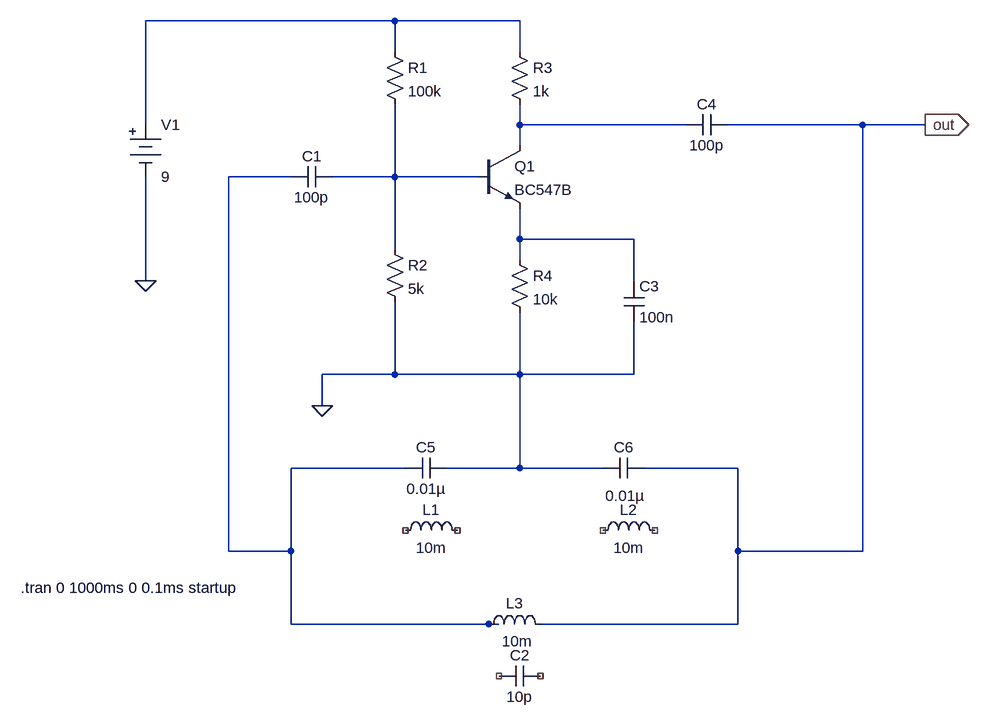
[diagram p0: schematic LC.asc]
LC.asc, the LTspice schematic file:
Version 4
SHEET 1 1376 936
WIRE 464 -128 80 -128
WIRE 656 -128 464 -128
WIRE 464 -80 464 -128
WIRE 656 -80 656 -128
WIRE 80 32 80 -128
WIRE 656 32 656 0
WIRE 912 32 656 32
WIRE 1184 32 976 32
WIRE 1280 32 1184 32
WIRE 656 64 656 32
WIRE 304 112 208 112
WIRE 464 112 464 0
WIRE 464 112 368 112
WIRE 592 112 464 112
WIRE 656 208 656 160
WIRE 832 208 656 208
WIRE 464 224 464 112
WIRE 656 240 656 208
WIRE 80 272 80 112
WIRE 832 272 832 208
WIRE 464 416 464 304
WIRE 464 416 352 416
WIRE 656 416 656 320
WIRE 656 416 464 416
WIRE 832 416 832 336
WIRE 832 416 656 416
WIRE 352 464 352 416
WIRE 480 560 304 560
WIRE 656 560 656 416
WIRE 656 560 544 560
WIRE 784 560 656 560
WIRE 992 560 848 560
WIRE 208 688 208 112
WIRE 304 688 304 560
WIRE 304 688 208 688
WIRE 992 688 992 560
WIRE 1184 688 1184 32
WIRE 1184 688 992 688
WIRE 304 800 304 688
WIRE 608 800 304 800
WIRE 624 800 608 800
WIRE 992 800 992 688
WIRE 992 800 688 800
FLAG 80 272 0
FLAG 352 464 0
FLAG 1280 32 out
IOPIN 1280 32 Out
SYMBOL res 448 -96 R0
SYMATTR InstName R1
SYMATTR Value 100k
SYMBOL res 640 -96 R0
SYMATTR InstName R3
SYMATTR Value 1k
SYMBOL res 448 208 R0
SYMATTR InstName R2
SYMATTR Value 5k
SYMBOL npn 592 64 R0
SYMATTR InstName Q1
SYMATTR Value BC547B
SYMBOL res 640 224 R0
SYMATTR InstName R4
SYMATTR Value 10k
SYMBOL cap 816 272 R0
SYMATTR InstName C3
SYMATTR Value 100n
SYMBOL cap 368 96 R90
WINDOW 0 0 32 VBottom 2
WINDOW 3 32 32 VTop 2
SYMATTR InstName C1
SYMATTR Value 100p
SYMBOL cap 976 16 R90
WINDOW 0 0 32 VBottom 2
WINDOW 3 32 32 VTop 2
SYMATTR InstName C4
SYMATTR Value 100p
SYMBOL ind 768 672 R270
WINDOW 0 32 56 VTop 2
WINDOW 3 5 56 VBottom 2
SYMATTR InstName L2
SYMATTR Value 10m
SYMBOL ind 464 672 R270
WINDOW 0 32 56 VTop 2
WINDOW 3 5 56 VBottom 2
SYMATTR InstName L1
SYMATTR Value 10m
SYMBOL cap 688 864 R90
WINDOW 0 0 32 VBottom 2
WINDOW 3 32 32 VTop 2
SYMATTR InstName C2
SYMATTR Value 10p
SYMBOL cap 544 544 R90
WINDOW 0 0 32 VBottom 2
WINDOW 3 32 32 VTop 2
SYMATTR InstName C5
SYMATTR Value 0.01µ
SYMBOL cap 848 544 R90
WINDOW 0 0 32 VBottom 2
WINDOW 3 43 30 VTop 2
SYMATTR InstName C6
SYMATTR Value 0.01µ
SYMBOL ind 592 816 R270
WINDOW 0 32 56 VTop 2
WINDOW 3 5 60 VBottom 2
SYMATTR InstName L3
SYMATTR Value 10m
SYMBOL Misc\\battery 80 16 R0
WINDOW 123 0 0 Left 0
WINDOW 39 0 0 Left 0
SYMATTR InstName V1
SYMATTR Value 9
TEXT -112 744 Left 2 !.tran 0 1000ms 0 0.1ms startup

The netlist it stands for:
* LC.asc
R1 N001 N004 100k
R3 N001 N002 1k
R2 N004 0 5k
Q1 N002 N004 N005 0 BC547B
R4 N005 0 10k
C3 N005 0 100n
C1 N004 N003 100p
C4 out N002 100p
L2 NC_01 NC_02 10m
L1 NC_03 NC_04 10m
C2 NC_05 NC_06 10p
C5 0 N003 0.01µ
C6 out 0 0.01µ
L3 N003 out 10m
V1 N001 0 9
.model NPN NPN
.model PNP PNP
.lib standard.bjt
.tran 0 1000ms 0 0.1ms startup
.backanno
.end